# Altium project PCB_Project.PrjPcb
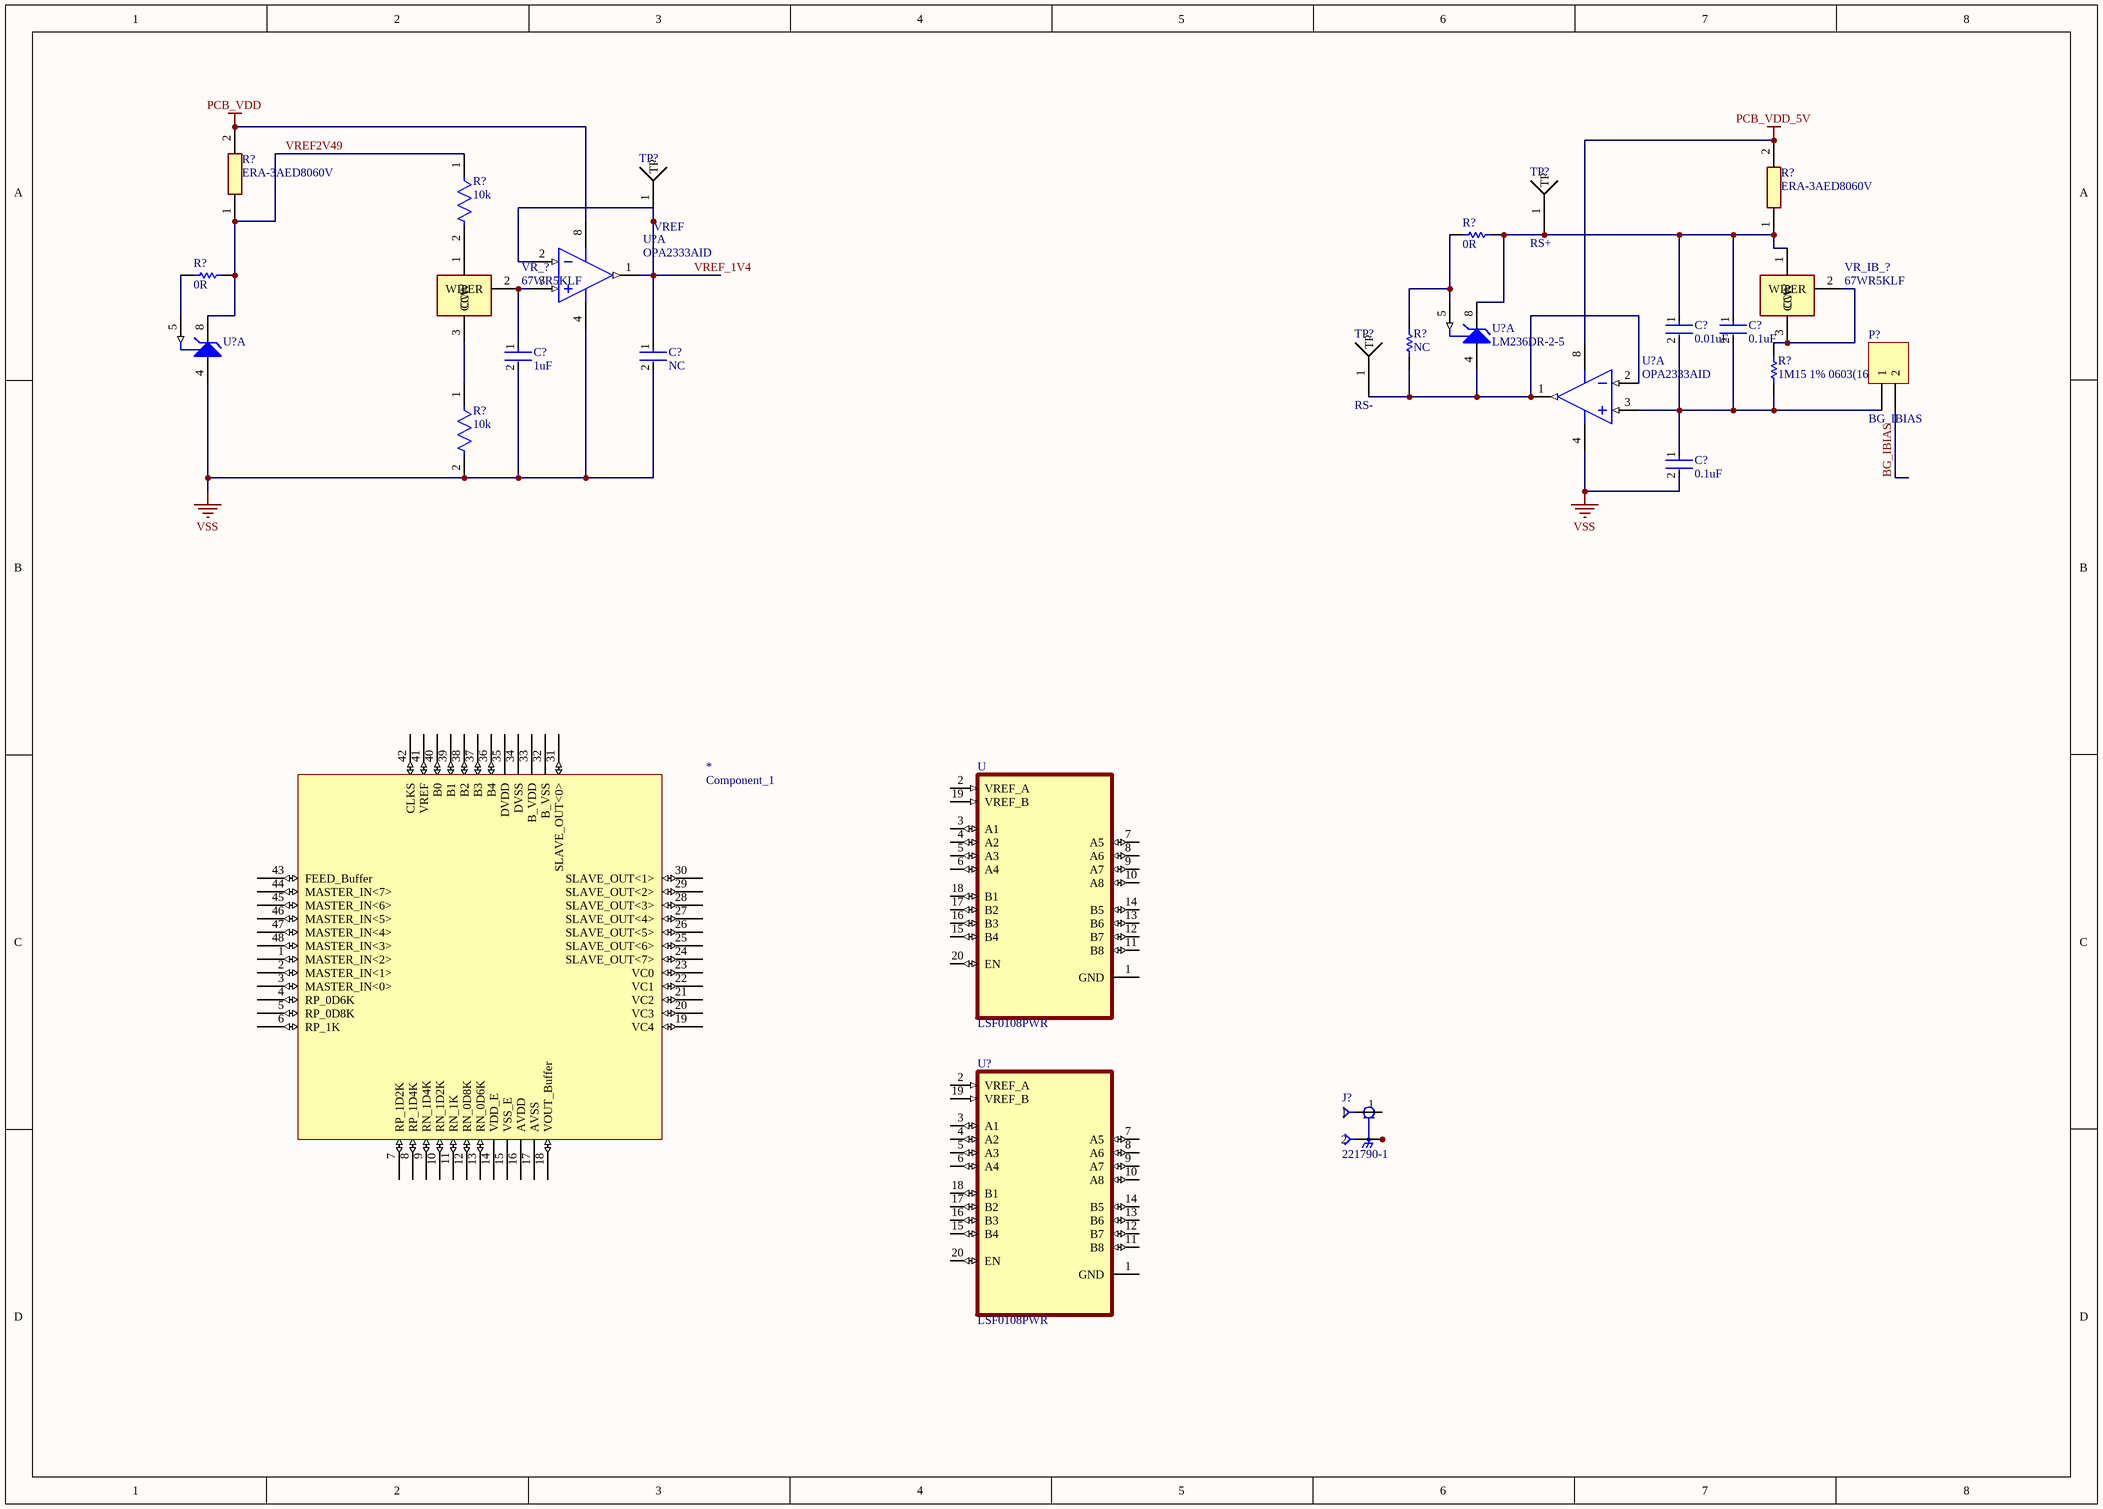
[diagram p0: ADPLL.SchDoc]
2 sheets, 140 parts. Net scope: global (net labels, ports and power ports of the same name join across sheets).
Board file: ADPLL_v1.PcbDoc
Sheets:
  ADPLL.SchDoc
  IADC_PCB_SCH.SchDoc

## Sheet ADPLL.SchDoc
size A3; SheetNumber: 1; SheetTotal: 2

### Parts
(Parts that share a designator on the sheet are numbered #1, #2 ... from top to bottom, then left to right.)
*  Component_1  [SB48(DIP48)]
C?#1  0.01uF  [FP-CC0603-DA-MFG]
C?#2  0.1uF  [FP-CC0603-DA-MFG]
C?#3  1uF  [FP-CC0603-DA-MFG]
C?#4  NC  [FP-CC0603-DA-MFG]
C?#5  0.1uF  [FP-CC0603-DA-MFG]
J?  221790-1  [TE_221790-1]
P?  BG_IBIAS  [HDR1X2]
R?#1  10k  [FP-RC0603-0_55-MFG]
R?#2  ERA-3AED8060V  [ERA3AEB101V]
R?#3  0R  [RESC1608X55X25ML10T15]
R?#4  ERA-3AED8060V  [ERA3AEB101V]
R?#5  0R  [RESC1608X55X25ML10T15]
R?#6  NC  [RESC1608X55X25ML10T15]
R?#7  10k  [FP-RC0603-0_55-MFG]
R?#8  1M15 1% 0603(1608)  [RESC0603(1608)_N]
TP?#1  VREF  [TEST_POINT]
TP?#2  RS+  [TEST_POINT]
TP?#3  RS-  [TEST_POINT]
U  LSF0108PWR  [SOP65P640X120-20N]
U?#1  OPA2333AID  [D0008A_L]  (part A of 2)
U?#2  LM236DR-2-5  [D0008A_M]  (part A of 2)
U?#3  (no value)  [D0008A_M]  (part A of 2)
U?#4  OPA2333AID  [D0008A_L]  (part A of 2)
U?#5  LSF0108PWR  [SOP65P640X120-20N]
VR_?  67WR5KLF  [67WR5KLF]
VR_IB_?  67WR5KLF  [67WR5KLF]

### Nets
PCB_VDD: R?#2.2 U?#1.8(V+)
PCB_VDD_5V: R?#4.2 U?#4.8(V+)
VSS: C?#3.2 C?#4.2 C?#5.2 R?#7.2 U?#1.4(V-) U?#3.4(ANODE) U?#4.4(V-)
BG_IBIAS: P?.2
VREF2V49: R?#1.1 R?#2.1 R?#5.2 U?#3.8(CATHODE)
VREF_1V4: C?#4.1 TP?#1.1(TP) U?#1.1(OUT_A) U?#1.2(IN_A-)
NetC?#1_1: C?#1.1 C?#2.1 R?#3.1 R?#4.1 TP?#2.1(TP) U?#2.8(CATHODE) VR_IB_?.1(CCW)
NetC?#1_2: C?#1.2 C?#2.2 C?#5.1 P?.1 R?#8.1 U?#4.3(IN_A+)
NetC?#3_1: C?#3.1 U?#1.3(IN_A+) VR_?.2(WIPER)
NetJ?_2: J?.2 J?.3 J?.4 J?.5
NetR?#1_2: R?#1.2 VR_?.1(CCW)
NetR?#3_2: R?#3.2 R?#6.1 U?#2.5(ADJ)
NetR?#5_1: R?#5.1 U?#3.5(ADJ)
NetR?#6_2: R?#6.2 TP?#3.1(TP) U?#2.4(ANODE) U?#4.1(OUT_A) U?#4.2(IN_A-)
NetR?#7_1: R?#7.1 VR_?.3(CW)
NetR?#8_2: R?#8.2 VR_IB_?.2(WIPER) VR_IB_?.3(CW)

Not connected (* = marked no-connect by the designer): * 1(MASTER_IN<2>) 2(MASTER_IN<1>) 3(MASTER_IN<0>) 4(RP_0D6K) 5(RP_0D8K) 6(RP_1K) 7(RP_1D2K) 8(RP_1D4K) 9(RN_1D4K) 10(RN_1D2K) 11(RN_1K) 12(RN_0D8K) 13(RN_0D6K) 14(VDD_E) 15(VSS_E) 16(AVDD) 17(AVSS) 18(VOUT_Buffer) 19(VC4) 20(VC3) 21(VC2) 22(VC1) 23(VC0) 24(SLAVE_OUT<7>) 25(SLAVE_OUT<6>) 26(SLAVE_OUT<5>) 27(SLAVE_OUT<4>) 28(SLAVE_OUT<3>) 29(SLAVE_OUT<2>) 30(SLAVE_OUT<1>) 31(SLAVE_OUT<0>) 32(B_VSS) 33(B_VDD) 34(DVSS) 35(DVDD) 36(B4) 37(B3) 38(B2) 39(B1) 40(B0) 41(VREF) 42(CLKS) 43(FEED_Buffer) 44(MASTER_IN<7>) 45(MASTER_IN<6>) 46(MASTER_IN<5>) 47(MASTER_IN<4>) 48(MASTER_IN<3>); J? 1; U 1(GND) 2(VREF_A) 3(A1) 4(A2) 5(A3) 6(A4) 7(A5) 8(A6) 9(A7) 10(A8) 11(B8) 12(B7) 13(B6) 14(B5) 15(B4) 16(B3) 17(B2) 18(B1) 19(VREF_B) 20(EN); U?#5 1(GND) 2(VREF_A) 3(A1) 4(A2) 5(A3) 6(A4) 7(A5) 8(A6) 9(A7) 10(A8) 11(B8) 12(B7) 13(B6) 14(B5) 15(B4) 16(B3) 17(B2) 18(B1) 19(VREF_B) 20(EN)

### Library data of the parts
C?#1 = CMP-2100-03600-2: CAP CER 10000PF 50V X7R 0603; Manufacturer Part Number: CC0603KRX7R9BB103; Manufacturer: YAGEO; Tolerance: 0.1; Material: Ceramic; Temperature Coefficient: 15%; Value: 10 nF; Mouser Description: Multilayer Ceramic Capacitor, CC Series, 0.01 - F, - 10%, X7R, 50 V, 0603 [1608 Metric]; Digikey Description: CAP CER 10000PF 50V X7R 0603; Height: 0.9mm; Category: Cap; Temperature Characteristic: X7R; Footprint Url: http://www.yageo.com/exep/pages/download/literatures/UPY-C_GEN_24.pdf; Lead Free: Yes; Voltage Rating: 50 V; Temperature: -55°C to +125°C; Device Class L3: Ceramic Capacitors; ComponentLink2Description: Datasheet; Voltage: 50 V; Package: CC0603-DA; Octopart: https://octopart.com/cc0603krx7r9bb103-yageo-192938; Automotive: No; Temperature Range High: +125°C; Temperature Range Low: -55°C; RoHS: TRUE; Device Class L1: Passive Components; ComponentLink2URL: http://www.yageo.com/documents/recent/UPY-GPHC_X7R_6.3V-to-50V_18.pdf; Device Class L2: Capacitors; Capacitance: 10 nF
C?#2 C?#5 = CMP-2100-03601-2: CAP CER 0.1UF 50V X7R 0603; Manufacturer: YAGEO; Manufacturer Part Number: CC0603KRX7R9BB104; Material: Ceramic; Capacitance: 100 nF; Temperature Coefficient: 15%; Tolerance: 0.1; Value: 100 nF; Height: 0.9mm; Voltage: 50 V; ComponentLink2Description: Datasheet; Device Class L2: Capacitors; Temperature Range High: +125°C; Category: Cap; Footprint Url: http://www.yageo.com/exep/pages/download/literatures/UPY-C_GEN_24.pdf; ComponentLink2URL: http://www.yageo.com/documents/recent/UPY-GPHC_X7R_6.3V-to-50V_18.pdf; Package: CC0603-DA; Temperature: -55°C to +125°C; Voltage Rating: 50 V; Temperature Characteristic: X7R; Device Class L1: Passive Components; Temperature Range Low: -55°C; RoHS: TRUE; Automotive: No; Device Class L3: Ceramic Capacitors; Octopart: https://octopart.com/cc0603krx7r9bb104-yageo-42244635; Mouser Description: Multilayer Ceramic Capacitor, CC Series, 0.1 - F, - 10%, X7R, 50 V, 0603 [1608 Metric]; Lead Free: Yes; Digikey Description: CAP CER 0.1UF 50V X7R 0603
C?#3 C?#4 = CMP-03422-000924-1: CAP CER 1UF 16V X7R 0603; Manufacturer: YAGEO; Manufacturer Part Number: CC0603KRX7R7BB105; Tolerance: 0.1; Temperature Coefficient: 15%; Material: Ceramic; Package: CC0603-DA; RoHS: TRUE; Device Class L2: Capacitors; Temperature Characteristic: X7R; Temperature: -55°C to +125°C; Temperature Range Low: -55°C; Automotive: No; ComponentLink2Description: Datasheet; Value: 1 uF; Lead Free: Yes; Capacitance: 1 uF; ComponentLink2URL: http://www.yageo.com/documents/recent/UPY-GPHC_X7R_6.3V-to-50V_18.pdf; Device Class L1: Passive Components; Voltage: 16 V; Octopart: https://octopart.com/cc0603krx7r7bb105-yageo-42271928; Category: Cap; Digikey Description: CAP CER 1UF 16V X7R 0603; Footprint Url: http://www.yageo.com/exep/pages/download/literatures/UPY-C_GEN_24.pdf; Height: 0.9mm; Voltage Rating: 16 V; Temperature Range High: +125°C; Mouser Description: Multilayer Ceramic Capacitor, CC Series, 1 - F, - 10%, X7R, 16 V, 0603 [1608 Metric]; Device Class L3: Ceramic Capacitors
J? = 221790-1: <b>Connector; SMA; PCB; Right Angle; Stainless Steel; 0.6 in.; Beryllium Copper</b>; Package: None; MP: 221790-1; Value: *; Availability: Unavailable; Price: None
P? = Header 2: Header, 2-Pin; LatestRevisionDate: 17-Jul-2002; LatestRevisionNote: Re-released for DXP Platform.; Publisher: Altium Limited
R?#1 R?#7 = CMP-2100-03664-2: RES 10K OHM 1% 1/10W 0603; Voltage Rating: 75V; Voltage Rating (DC): 50V; Resistance: 10kR; Power Rating: 100mW; Temperature Coefficient: 100ppm/°C; Depth: 0.8mm; Termination: SMD/SMT; Resistor Type: Thick Film; Series: RC; Construction: Rectangular; Features: Moisture Resistant; Packaging: Tape and Reel; Min Operating Temperature: -55°C; Number of Terminations: 2; Lead Pitch: 0.3mm; RoHS Compliant: Yes; Case/Package: 0603; Resistance Tolerance: 1%; Military Standard: Not; Weight: 7.1E-05oz; Number of Pins: 2; Tolerance: 1%; Length: 1.6mm; Case Code (Imperial): 0603; Lead Free: Lead Free; Width: 0.8mm; Max Power Dissipation: 100mW; Height: 0.45mm; Max Operating Temperature: 155°C; Case Code (Metric): 1608; Size Code: 0603
R?#2 R?#4 = ERA-3AED8060V: Resistor; Manufacturer_Name: Panasonic; Datasheet Link: https://industrial.panasonic.com/cdbs/www-data/pdf/RDM0000/AOA0000C307.pdf; Height: 0.55mm; Manufacturer_Part_Number: ERA-3AED8060V; Mouser Part Number: 667-ERA-3AED8060V; Mouser Price/Stock: https://www.mouser.co.uk/ProductDetail/Panasonic/ERA-3AED8060V?qs=MNPzkKEzRtQXSFvTLdZNVA%3D%3D; Arrow Part Number: ERA-3AED8060V; Arrow Price/Stock: https://www.arrow.com/en/products/era-3aed8060v/panasonic
R?#3 R?#5 R?#6 = CMP-2100-03667-1: Chip Resistor, 0 Ohm, +/- 5%, 0.1 W, -55 to 155 degC, 0603 (1608 Metric), RoHS, Tape and Reel; Manufacturer: Yageo; Temperature Coefficient: 200ppm/degreesC; Voltage Rating: 50V; Power Rating: 100mW; Resistance: 0mOhm; Width: 0.8mm; Max Operating Temperature: 155degC; Tolerance: 5%; Package Reference: 0603; Height: 0.45mm; Depth: 0.8mm; Package Description: 2-Pin Surface Mount Device, Body 1.6 x 0.8 mm; Termination: SMD/SMT; Package Quantity: 5000; Case/Package: 0603; Case Code (Imperial): 0603; Radiation Hardening: No; Number of Pins: 2; Length: 1.6mm; Lead Free: LeadFree; Voltage Rating (DC): 50V; Military Standard: Not; Datasheet URL: http://www.yageo.com/NewPortal/yageodocoutput?fileName=/pdf/R-Chip/PYu-RC_Group_51_RoHS_L_5.pdf; Manufacturer URL: http://www.yageo.com/; Packaging: TapeandReel; Case Code (Metric): 1608; Min Operating Temperature: -55degC; Composition: ThickFilm; RoHSCompliant: true; Contact Plating: Tin; Datasheet Version: Rev. 5, 10/2016; REACH SVHC: NoSVHC
R?#8 = CMP-1012-00855-1: 1M15 0.1W 1% 0603 (1608 Metric)  SMD; Value: 1150000.00 Ohm; Case-EIA: 0603; Case-Metric: 1608; Technology: SMT; Power: 0.1 W; Tolerance: 1 %
TP?#1-TP?#3 = TP
U U?#5 = LSF0108PWR: Octal Bidirectional Multi-Voltage-Level Translator 20-TSSOP -40 to 125; MF: Texas Instruments; Texas_Instruments-Purchase-URL: https://snapeda.com/shop?store=Texas+Instruments&id=353489; SnapEDA_Link: https://www.snapeda.com/parts/LSF0108PWR/Texas%20Instruments/view-part/353489/?ref=snap; Value: *; Package: TSSOP-20 Texas Instruments; MP: LSF0108PWR
U?#1 U?#4 = CMP-0272-00776-3: 17 uA, MicroPower, Precision, Zero Drift CMOS Operational Amplifier, 1.8 to 5.5 V, -40 to 125 degC, 8-pin SOIC (D8), Green (RoHS & no Sb/Br); Manufacturer: Texas Instruments; CMRR(Min)(dB): 106; IIB(Max)(pA): 200; Sub Family: Low Offset Voltage Amplifier (<=500uV), Low Power Amp (<=500uA), Low Supply Voltage Amplifier (<=2.7V), Precision Amplifier, Zero Drift Precision Amplifier; Number of Channels: 2; Vio (25C)(Max)(mV): 0.01; Slew Rate(Typ)(V/us): 0.16; Total Supply Voltage(Min)(+5V is 5, +/-5V is 10): 1.8; Total Supply Voltage(Max)(+5V is 5, +/-5V is 10): 5.5; Offset Drift(Typ)(uV/C): 0.02; Iq per channel(Max)(mA): 0.025; ComponentLink3Description: Package Specification; ComponentLink2URL: http://www.ti.com/general/docs/lit/getliterature.tsp?genericPartNumber=OPA2333&fileType=pdf; PackageDescription: 8-Pin Plastic Small Outline, Body 4.9 x 3.9 mm, Pitch 1.27 mm; PackageVersion: 4040047-3/M, 06/2011; Eco-Plan: Green (RoHS & no Sb/Br); ComponentLink1Description: Manufacturer URL; ComponentLink1URL: http://www.ti.com/; ComponentLink2Description: Datasheet; PartNumber: OPA2333AID; Mounting Technology: Surface Mount; DatasheetVersion: SBOS351C; ComponentLink3URL: http://www.ti.com/litv/pdf/msoi002j; PackageReference: D0008A; Code_JEDEC: MS-012
U?#2 = CMP-0366-00496-2: Integrated Reference Circuit, 2.49 V, 13 ppm / degC, 10 mA, -25 to 85 degC, 8-pin SOIC (D), Green (RoHS & no Sb/Br); Manufacturer: Texas Instruments; Iout/Iz(Max)(mA): 10; Initial Accuracy @ 25/deg C(%): 2; Min Iz for Regulation(uA): 400; SubFamily: Shunt Voltage Reference; Temp Coeff(Typ)(ppm/ degree C): 13; Rating: Catalog; VO(V): 2.49; Temp Coeff(Max)(ppm/ degree C): 33; Mounting Technology: Surface Mount; PackageReference: D0008A; ComponentLink1URL: http://www.ti.com/; ComponentLink2URL: http://www.ti.com/general/docs/lit/getliterature.tsp?genericPartNumber=LM236-2.5&fileType=pdf; PackageVersion: 4040047-3/M; PackageDescription: 8-Pin Plastic Small Outline, Body 4.9 x 3.9 mm, Pitch 1.27 mm; ComponentLink2Description: Datasheet; ComponentLink3Description: Package Specification; ComponentLink1Description: Manufacturer URL; ComponentLink3URL: http://www.ti.com/litv/pdf/msoi002j; Eco-Plan: Green (RoHS & no Sb/Br); DatasheetVersion: SLVS063E; PartNumber: LM236DR-2-5; Code_JEDEC: MS-012
U?#3 = CMP-0366-00496-2: Integrated Reference Circuit, 2.49 V, 13 ppm / degC, 10 mA, -25 to 85 degC, 8-pin SOIC (D), Green (RoHS & no Sb/Br); Manufacturer: Texas Instruments; PartNumber: LM236DR-2-5; Iout/Iz(Max)(mA): 10; Initial Accuracy @ 25/deg C(%): 2; Min Iz for Regulation(uA): 400; SubFamily: Shunt Voltage Reference; Temp Coeff(Typ)(ppm/ degree C): 13; Rating: Catalog; VO(V): 2.49; Temp Coeff(Max)(ppm/ degree C): 33; Mounting Technology: Surface Mount; PackageReference: D0008A; ComponentLink1URL: http://www.ti.com/; ComponentLink2URL: http://www.ti.com/general/docs/lit/getliterature.tsp?genericPartNumber=LM236-2.5&fileType=pdf; PackageVersion: 4040047-3/M; PackageDescription: 8-Pin Plastic Small Outline, Body 4.9 x 3.9 mm, Pitch 1.27 mm; ComponentLink2Description: Datasheet; ComponentLink3Description: Package Specification; ComponentLink1Description: Manufacturer URL; ComponentLink3URL: http://www.ti.com/litv/pdf/msoi002j; Eco-Plan: Green (RoHS & no Sb/Br); DatasheetVersion: SLVS063E; Code_JEDEC: MS-012
VR_? = 67WR5KLF: Variable Resistor 5K; Manufacturer_Name: TT Electronics; Datasheet Link: https://datasheet.datasheetarchive.com/originals/distributors/Datasheets-DGA16/937159.pdf; Height: 12.36mm; Manufacturer_Part_Number: 67WR5KLF; Mouser Part Number: 858-67WR5KLF; Mouser Price/Stock: https://www.mouser.co.uk/ProductDetail/BI-Technologies-TT-Electronics/67WR5KLF?qs=gQBTb7UQo2IZpYWbSQGElA%3D%3D; Arrow Part Number: 67WR5KLF; Arrow Price/Stock: https://www.arrow.com/en/products/67wr5klf/bi-technologies?region=europe
VR_IB_? = 67WR5KLF: Variable Resistor 10K; Manufacturer_Name: TT Electronics; Datasheet Link: https://datasheet.datasheetarchive.com/originals/distributors/Datasheets-DGA16/937159.pdf; Height: 12.36mm; Manufacturer_Part_Number: 67WR5KLF; Mouser Part Number: 858-67WR5KLF; Mouser Price/Stock: https://www.mouser.co.uk/ProductDetail/BI-Technologies-TT-Electronics/67WR5KLF?qs=gQBTb7UQo2IZpYWbSQGElA%3D%3D; Arrow Part Number: 67WR5KLF; Arrow Price/Stock: https://www.arrow.com/en/products/67wr5klf/bi-technologies?region=europe

## Sheet IADC_PCB_SCH.SchDoc
size A2; SheetNumber: 1; SheetTotal: 1; SPICEModelCacheYJWEAEQR: <root> / <DocumentId>YJWEAEQR</DocumentId> / </root>
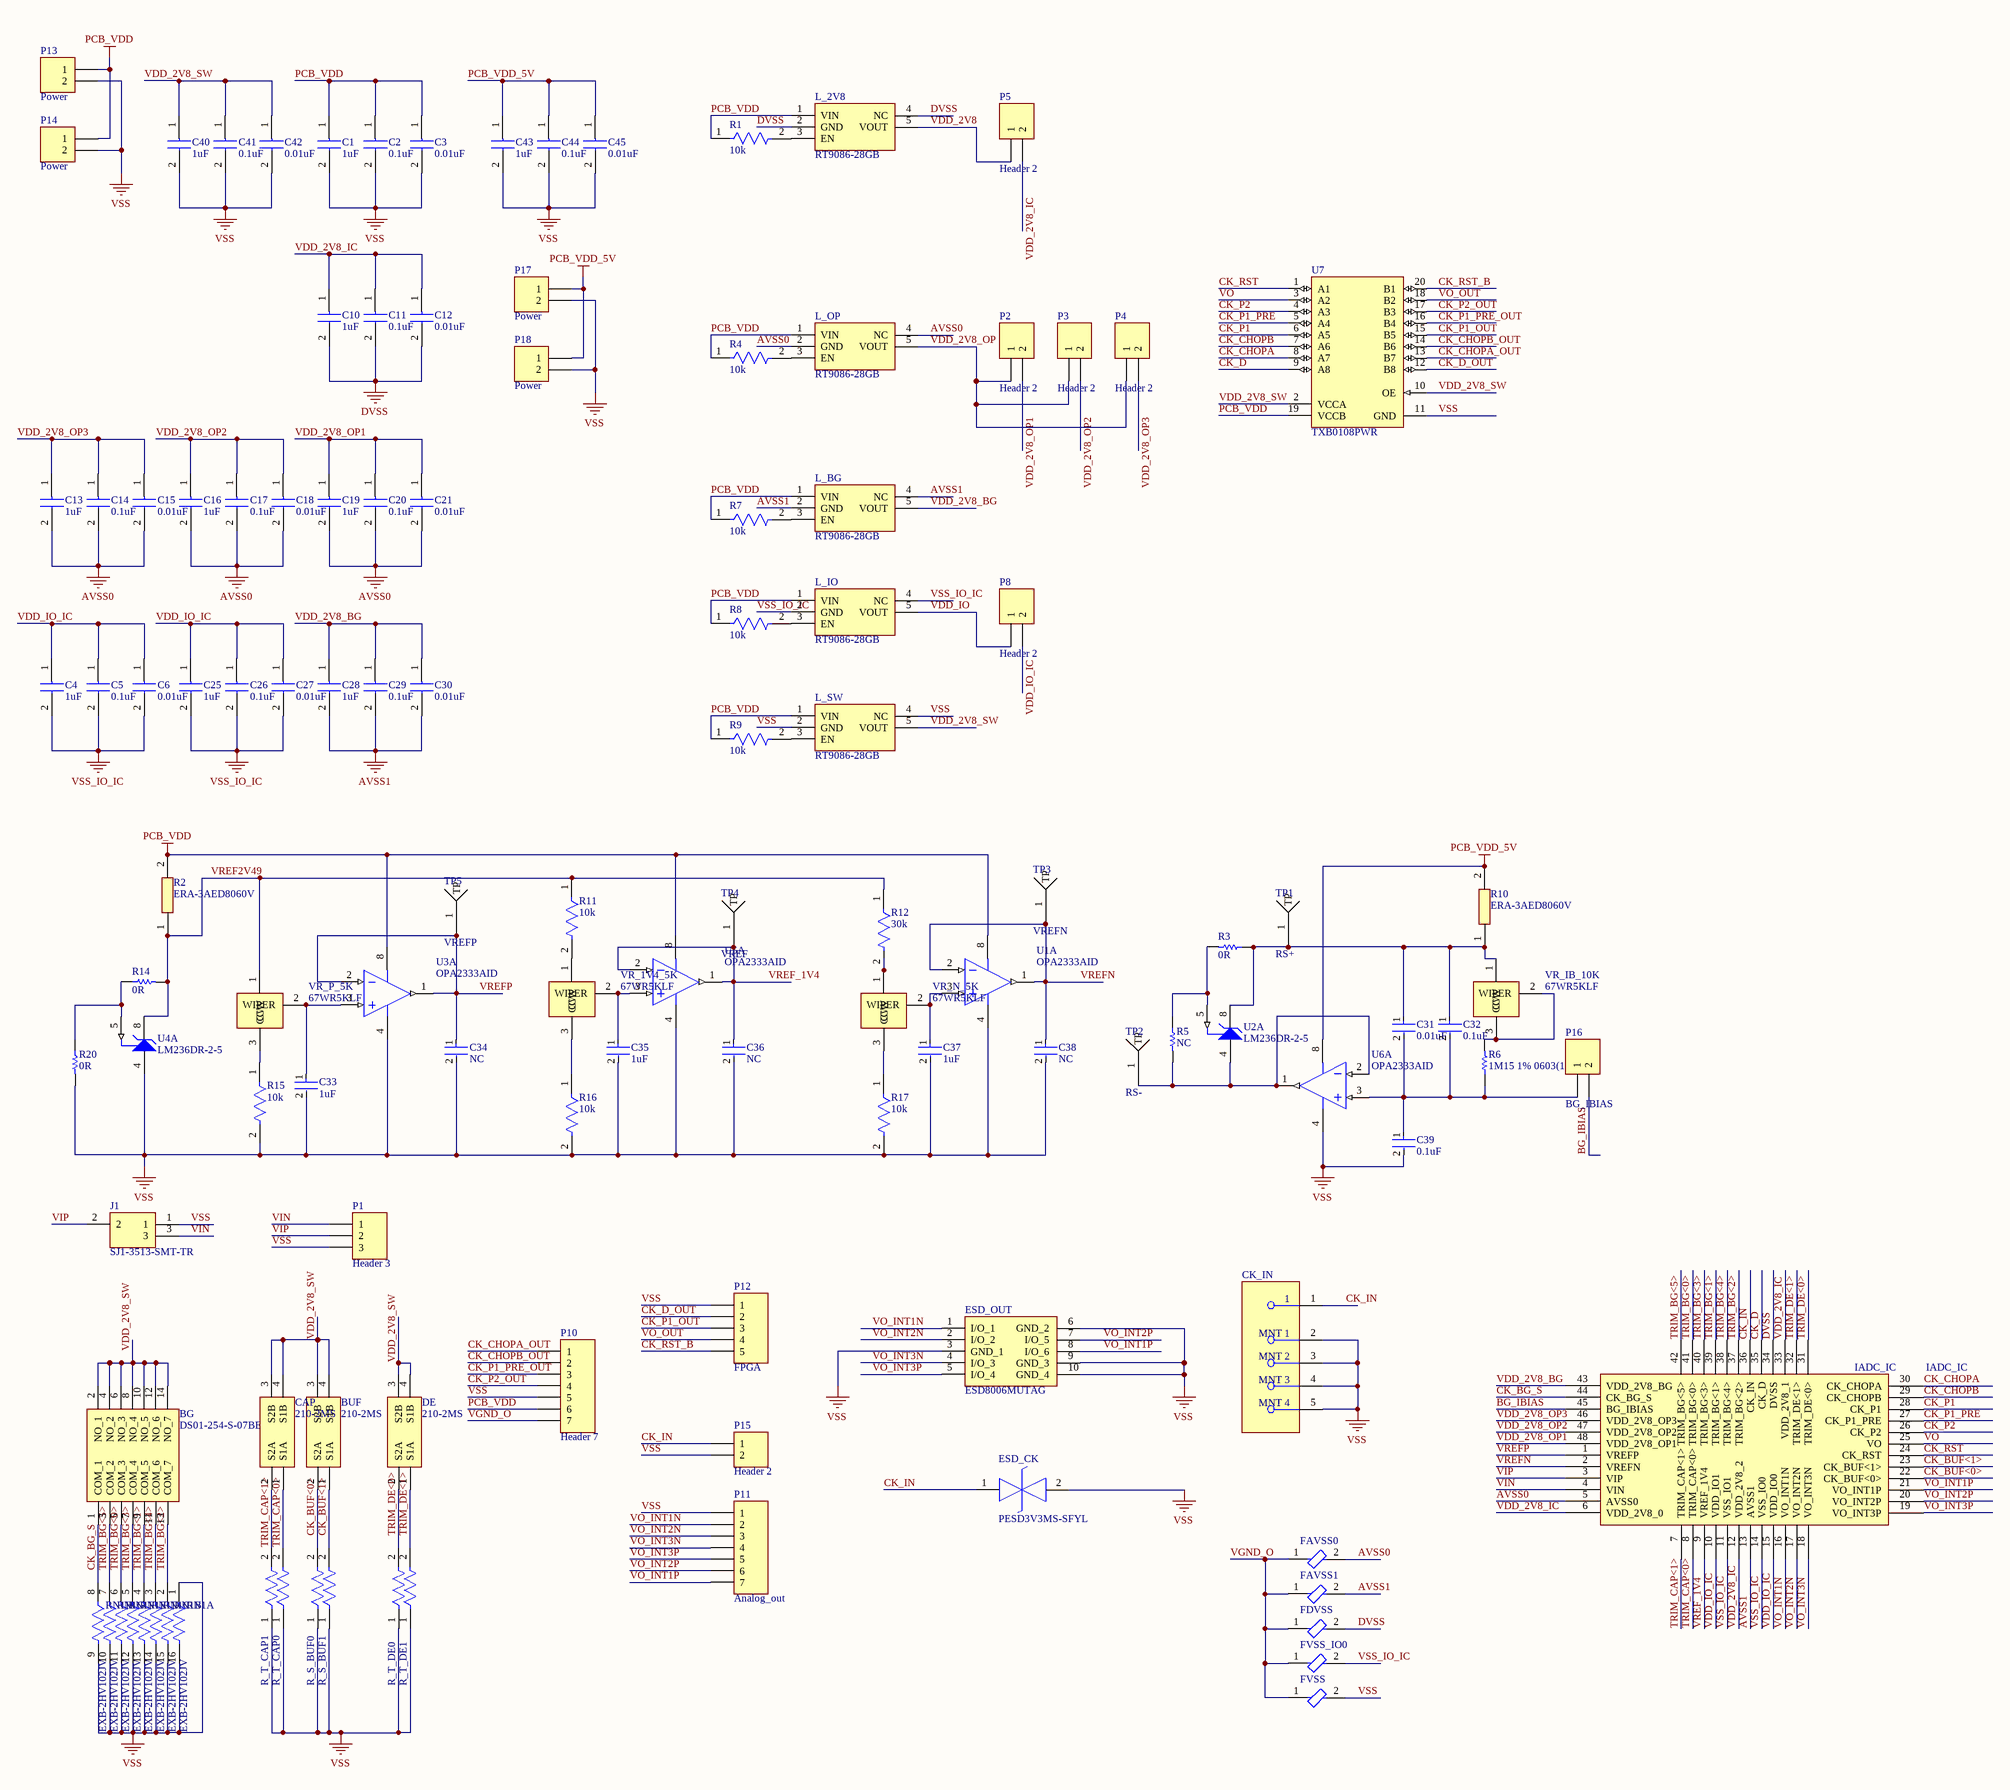
[diagram p1: IADC_PCB_SCH.SchDoc]

### Parts
BG  DS01-254-S-07BE  [DS01254S07BE]
BUF  210-2MS  [DIP775W63P254L655H458Q4N]
C1  1uF  [CAPC1608X95N]
C2  0.1uF  [CAPC1608X90N]
C3  0.01uF  [CAPC1608X95N]
C4  1uF  [CAPC1608X95N]
C5  0.1uF  [CAPC1608X90N]
C6  0.01uF  [CAPC1608X95N]
C10  1uF  [CAPC1608X95N]
C11  0.1uF  [CAPC1608X90N]
C12  0.01uF  [CAPC1608X95N]
C13  1uF  [CAPC1608X95N]
C14  0.1uF  [CAPC1608X90N]
C15  0.01uF  [CAPC1608X95N]
C16  1uF  [CAPC1608X95N]
C17  0.1uF  [CAPC1608X90N]
C18  0.01uF  [CAPC1608X95N]
C19  1uF  [CAPC1608X95N]
C20  0.1uF  [CAPC1608X90N]
C21  0.01uF  [CAPC1608X95N]
C25  1uF  [CAPC1608X95N]
C26  0.1uF  [CAPC1608X90N]
C27  0.01uF  [CAPC1608X95N]
C28  1uF  [CAPC1608X95N]
C29  0.1uF  [CAPC1608X90N]
C30  0.01uF  [CAPC1608X95N]
C31  0.01uF  [FP-CC0603-DA-MFG]
C32  0.1uF  [FP-CC0603-DA-MFG]
C33  1uF  [FP-CC0603-DA-MFG]
C34  NC  [FP-CC0603-DA-MFG]
C35  1uF  [FP-CC0603-DA-MFG]
C36  NC  [FP-CC0603-DA-MFG]
C37  1uF  [FP-CC0603-DA-MFG]
C38  NC  [FP-CC0603-DA-MFG]
C39  0.1uF  [FP-CC0603-DA-MFG]
C40  1uF  [CAPC1608X95N]
C41  0.1uF  [CAPC1608X90N]
C42  0.01uF  [CAPC1608X95N]
C43  1uF  [CAPC1608X95N]
C44  0.1uF  [CAPC1608X90N]
C45  0.01uF  [CAPC1608X95N]
CAP  210-2MS  [DIP775W63P254L655H458Q4N]
CK_IN  221790-1  [FP-221790-1-MFG]  (value not drawn)
DE  210-2MS  [DIP775W63P254L655H458Q4N]
ESD_CK  PESD3V3MS-SFYL  [PMEG3005AESFYL]
ESD_OUT  ESD8006MUTAG  [ESD8006MUTAG]
FAVSS0  742792609  [FP-742792609-MFG]  (value not drawn)
FAVSS1  742792609  [FP-742792609-MFG]  (value not drawn)
FDVSS  742792609  [FP-742792609-MFG]  (value not drawn)
FVSS  742792609  [FP-742792609-MFG]  (value not drawn)
FVSS_IO0  742792609  [FP-742792609-MFG]  (value not drawn)
IADC_IC  IADC_IC  [SB48 (DIP48)]
J1  SJ1-3513-SMT-TR  [SJ13513SMTTR]
L_2V8  RT9086-28GB  [SOT94P279X130-5N]
L_BG  RT9086-28GB  [SOT94P279X130-5N]
L_IO  RT9086-28GB  [SOT94P279X130-5N]
L_OP  RT9086-28GB  [SOT94P279X130-5N]
L_SW  RT9086-28GB  [SOT94P279X130-5N]
P1  Header 3  [HDR1X3]
P2  Header 2  [HDR1X2]
P3  Header 2  [HDR1X2]
P4  Header 2  [HDR1X2]
P5  Header 2  [HDR1X2]
P8  Header 2  [HDR1X2]
P10  Header 7  [HDR1X7]
P11  Analog_out  [HDR1X7]
P12  FPGA  [HDR1X5]
P13  Power  [HDR1X2]
P14  Power  [HDR1X2]
P15  Header 2  [HDR1X2]
P16  BG_IBIAS  [HDR1X2]
P17  Power  [HDR1X2]
P18  Power  [HDR1X2]
R1  10k  [FP-RC0603-0_55-IPC_C]
R2  ERA-3AED8060V  [ERA3AEB101V]
R3  0R  [RESC1608X55X25ML10T15]
R4  10k  [FP-RC0603-0_55-IPC_C]
R5  NC  [RESC1608X55X25ML10T15]
R6  1M15 1% 0603(1608)  [RESC0603(1608)_N]
R7  10k  [FP-RC0603-0_55-IPC_C]
R8  10k  [FP-RC0603-0_55-IPC_C]
R9  10k  [FP-RC0603-0_55-IPC_C]
R10  ERA-3AED8060V  [ERA3AEB101V]
R11  10k  [FP-RC0603-0_55-MFG]
R12  30k  [FP-RC0603-0_55-MFG]
R14  0R  [RESC1608X55X25ML10T15]
R15  10k  [FP-RC0603-0_55-MFG]
R16  10k  [FP-RC0603-0_55-MFG]
R17  10k  [FP-RC0603-0_55-MFG]
R20  0R  [RESC1608X55X25ML10T15]
R_S_BUF0  RT0603BRD071KL  [FP-RT0603-MFG]  (value not drawn)
R_S_BUF1  RT0603BRD071KL  [FP-RT0603-MFG]  (value not drawn)
R_T_CAP0  RT0603BRD071KL  [FP-RT0603-MFG]  (value not drawn)
R_T_CAP1  RT0603BRD071KL  [FP-RT0603-MFG]  (value not drawn)
R_T_DE0  RT0603BRD071KL  [FP-RT0603-MFG]  (value not drawn)
R_T_DE1  RT0603BRD071KL  [FP-RT0603-MFG]  (value not drawn)
RN1  EXB-2HV102JV  [FP-EXB2HV-MFG]  (parts A,B,C,D,E,F,G,H of 8)
TP1  RS+  [TEST_POINT]
TP2  RS-  [TEST_POINT]
TP3  VREFN  [TEST_POINT]
TP4  VREF  [TEST_POINT]
TP5  VREFP  [TEST_POINT]
U1  OPA2333AID  [D0008A_L]  (part A of 2)
U2  LM236DR-2-5  [D0008A_M]  (part A of 2)
U3  OPA2333AID  [D0008A_L]  (part A of 2)
U4  LM236DR-2-5  [D0008A_M]  (part A of 2)
U5  OPA2333AID  [D0008A_L]  (part A of 2)
U6  OPA2333AID  [D0008A_L]  (part A of 2)
U7  TXB0108PWR  [PW0020A_L]
VR_1V4_5K  67WR5KLF  [67WR5KLF]
VR_IB_10K  67WR5KLF  [67WR5KLF]
VR_N_5K  67WR5KLF  [67WR5KLF]
VR_P_5K  67WR5KLF  [67WR5KLF]

### Nets
AVSS0: C13.2 C14.2 C15.2 C16.2 C17.2 C18.2 C19.2 C20.2 C21.2 FAVSS0.2 IADC_IC.5(AVSS0) L_OP.2(GND) L_OP.4(NC)
AVSS1: C28.2 C29.2 C30.2 FAVSS1.2 IADC_IC.13(AVSS1) L_BG.2(GND) L_BG.4(NC)
DVSS: C10.2 C11.2 C12.2 FDVSS.2 IADC_IC.34(DVSS) L_2V8.2(GND) L_2V8.4(NC)
PCB_VDD: C1.1 C2.1 C3.1 L_2V8.1(VIN) L_BG.1(VIN) L_IO.1(VIN) L_OP.1(VIN) L_SW.1(VIN) P10.6 P13.1 P14.1 R1.1 R2.2 R4.1 R7.1 R8.1 R9.1 U1.8(V+) U3.8(V+) U5.8(V+) U7.19(VCCB)
PCB_VDD_5V: C43.1 C44.1 C45.1 P17.1 P18.1 R10.2 U6.8(V+)
VSS: C1.2 C2.2 C3.2 C33.2 C34.2 C35.2 C36.2 C37.2 C38.2 C39.2 C40.2 C41.2 C42.2 C43.2 C44.2 C45.2 CK_IN.2(MNT_1) CK_IN.3(MNT_2) CK_IN.4(MNT_3) CK_IN.5(MNT_4) ESD_CK.2(K2) ESD_OUT.3(GND_1) ESD_OUT.6(GND_2) ESD_OUT.9(GND_3) ESD_OUT.10(GND_4) FVSS.2 J1.1 L_SW.2(GND) L_SW.4(NC) P1.3 P10.5 P11.1 P12.1 P13.2 P14.2 P15.2 P17.2 P18.2 R15.2 R16.2 R17.2 R20.2 R_S_BUF0.1 R_S_BUF1.1 R_T_CAP0.1 R_T_CAP1.1 R_T_DE0.1 R_T_DE1.1 RN1.1 RN1.9 RN1.10 RN1.11 RN1.12 RN1.13 RN1.14 RN1.15 RN1.16 U1.4(V-) U3.4(V-) U4.4(ANODE) U5.4(V-) U6.4(V-) U7.11(GND)
VSS_IO_IC: C4.2 C5.2 C6.2 C25.2 C26.2 C27.2 FVSS_IO0.2 IADC_IC.11(VSS_IO1) IADC_IC.14(VSS_IO0) L_IO.2(GND) L_IO.4(NC)
BG_IBIAS: IADC_IC.45(BG_IBIAS) P16.2
CK_BG_S: BG.1(COM_1) IADC_IC.44(CK_BG_S) RN1.8
CK_BUF<0>: BUF.2(S2A) IADC_IC.22(CK_BUF<0>) R_S_BUF0.2
CK_BUF<1>: BUF.1(S1A) IADC_IC.23(CK_BUF<1>) R_S_BUF1.2
CK_CHOPA: IADC_IC.30(CK_CHOPA) U7.8(A7)
CK_CHOPA_OUT: P10.1 U7.13(B7)
CK_CHOPB: IADC_IC.29(CK_CHOPB) U7.7(A6)
CK_CHOPB_OUT: P10.2 U7.14(B6)
CK_D: IADC_IC.35(CK_D) U7.9(A8)
CK_D_OUT: P12.2 U7.12(B8)
CK_IN: CK_IN.1 ESD_CK.1(K1) IADC_IC.36(CK_IN) P15.1
CK_P1: IADC_IC.28(CK_P1) U7.6(A5)
CK_P1_OUT: P12.3 U7.15(B5)
CK_P1_PRE: IADC_IC.27(CK_P1_PRE) U7.5(A4)
CK_P1_PRE_OUT: P10.3 U7.16(B4)
CK_P2: IADC_IC.26(CK_P2) U7.4(A3)
CK_P2_OUT: P10.4 U7.17(B3)
CK_RST: IADC_IC.24(CK_RST) U7.1(A1)
CK_RST_B: P12.5 U7.20(B1)
TRIM_BG<0>: BG.5(COM_3) IADC_IC.41(TRIM_BG<0>) RN1.6
TRIM_BG<1>: BG.9(COM_5) IADC_IC.39(TRIM_BG<1>) RN1.4
TRIM_BG<2>: BG.13(COM_7) IADC_IC.37(TRIM_BG<2>) RN1.2
TRIM_BG<3>: BG.7(COM_4) IADC_IC.40(TRIM_BG<3>) RN1.5
TRIM_BG<4>: BG.11(COM_6) IADC_IC.38(TRIM_BG<4>) RN1.3
TRIM_BG<5>: BG.3(COM_2) IADC_IC.42(TRIM_BG<5>) RN1.7
TRIM_CAP<0>: CAP.1(S1A) IADC_IC.8(TRIM_CAP<0>) R_T_CAP0.2
TRIM_CAP<1>: CAP.2(S2A) IADC_IC.7(TRIM_CAP<1>) R_T_CAP1.2
TRIM_DE<0>: DE.2(S2A) IADC_IC.31(TRIM_DE<0>) R_T_DE0.2
TRIM_DE<1>: DE.1(S1A) IADC_IC.32(TRIM_DE<1>) R_T_DE1.2
VDD_2V8: L_2V8.5(VOUT) P5.1
VDD_2V8_BG: C28.1 C29.1 C30.1 IADC_IC.43(VDD_2V8_BG) L_BG.5(VOUT)
VDD_2V8_IC: C10.1 C11.1 C12.1 IADC_IC.6(VDD_2V8_0) IADC_IC.12(VDD_2V8_2) IADC_IC.33(VDD_2V8_1) P5.2
VDD_2V8_OP: L_OP.5(VOUT) P2.1 P3.1 P4.1
VDD_2V8_OP1: C19.1 C20.1 C21.1 IADC_IC.48(VDD_2V8_OP1) P2.2
VDD_2V8_OP2: C16.1 C17.1 C18.1 IADC_IC.47(VDD_2V8_OP2) P3.2
VDD_2V8_OP3: C13.1 C14.1 C15.1 IADC_IC.46(VDD_2V8_OP3) P4.2
VDD_2V8_SW: BG.2(NO_1) BG.4(NO_2) BG.6(NO_3) BG.8(NO_4) BG.10(NO_5) BG.12(NO_6) BG.14(NO_7) BUF.3(S2B) BUF.4(S1B) C40.1 C41.1 C42.1 CAP.3(S2B) CAP.4(S1B) DE.3(S2B) DE.4(S1B) L_SW.5(VOUT) U7.2(VCCA) U7.10(OE)
VDD_IO: L_IO.5(VOUT) P8.1
VDD_IO_IC: C4.1 C5.1 C6.1 C25.1 C26.1 C27.1 IADC_IC.10(VDD_IO1) IADC_IC.15(VDD_IO0) P8.2
VGND_O: FAVSS0.1 FAVSS1.1 FDVSS.1 FVSS.1 FVSS_IO0.1 P10.7
VIN: IADC_IC.4(VIN) J1.3 P1.1
VIP: IADC_IC.3(VIP) J1.2 P1.2
VO: IADC_IC.25(VO) U7.3(A2)
VO_INT1N: ESD_OUT.1(I/O_1) IADC_IC.16(VO_INT1N) P11.2
VO_INT1P: ESD_OUT.8(I/O_6) IADC_IC.21(VO_INT1P) P11.7
VO_INT2N: ESD_OUT.2(I/O_2) IADC_IC.17(VO_INT2N) P11.3
VO_INT2P: ESD_OUT.7(I/O_5) IADC_IC.20(VO_INT2P) P11.6
VO_INT3N: ESD_OUT.4(I/O_3) IADC_IC.18(VO_INT3N) P11.4
VO_INT3P: ESD_OUT.5(I/O_4) IADC_IC.19(VO_INT3P) P11.5
VO_OUT: P12.4 U7.18(B2)
VREF2V49: R2.1 R11.1 R12.1 R14.2 U4.8(CATHODE) VR_P_5K.1(CCW)
VREF_1V4: C36.1 IADC_IC.9(VREF_1V4) TP4.1(TP) U5.1(OUT_A) U5.2(IN_A-)
VREFN: C38.1 IADC_IC.2(VREFN) TP3.1(TP) U1.1(OUT_A) U1.2(IN_A-)
VREFP: C34.1 IADC_IC.1(VREFP) TP5.1(TP) U3.1(OUT_A) U3.2(IN_A-)
NetC31_1: C31.1 C32.1 R3.1 R10.1 TP1.1(TP) U2.8(CATHODE) VR_IB_10K.1(CCW)
NetC31_2: C31.2 C32.2 C39.1 P16.1 R6.1 U6.3(IN_A+)
NetC33_1: C33.1 U3.3(IN_A+) VR_P_5K.2(WIPER)
NetC35_1: C35.1 U5.3(IN_A+) VR_1V4_5K.2(WIPER)
NetC37_1: C37.1 U1.3(IN_A+) VR_N_5K.2(WIPER)
NetL_2V8_3: L_2V8.3(EN) R1.2
NetL_BG_3: L_BG.3(EN) R7.2
NetL_IO_3: L_IO.3(EN) R8.2
NetL_OP_3: L_OP.3(EN) R4.2
NetL_SW_3: L_SW.3(EN) R9.2
NetR3_2: R3.2 R5.1 U2.5(ADJ)
NetR5_2: R5.2 TP2.1(TP) U2.4(ANODE) U6.1(OUT_A) U6.2(IN_A-)
NetR6_2: R6.2 VR_IB_10K.2(WIPER) VR_IB_10K.3(CW)
NetR11_2: R11.2 VR_1V4_5K.1(CCW)
NetR12_2: R12.2 VR_N_5K.1(CCW)
NetR14_1: R14.1 R20.1 U4.5(ADJ)
NetR15_1: R15.1 VR_P_5K.3(CW)
NetR16_1: R16.1 VR_1V4_5K.3(CW)
NetR17_1: R17.1 VR_N_5K.3(CW)

### Library data of the parts
BG = DS01-254-S-07BE: Switch; Manufacturer_Name: CUI Devices; Datasheet Link: https://www.mouser.in/datasheet/2/670/ds01_254-1777712.pdf; Height: 7mm; Manufacturer_Part_Number: DS01-254-S-07BE; Mouser Part Number: 490-DS01-254-S-07BE; Mouser Price/Stock: https://www.mouser.co.uk/ProductDetail/CUI-Devices/DS01-254-S-07BE?qs=wnTfsH77Xs4LW3hFeno2Ow%3D%3D; Arrow Part Number: DS01-254-S-07BE; Arrow Price/Stock: https://www.arrow.com/en/products/ds01-254-s-07be/cui-devices?region=nac
BUF CAP DE = 210-2MS: Switch; Manufacturer_Name: CTS; Datasheet Link: https://componentsearchengine.com/Datasheets/1/210-2MS.pdf; Height: 4.58mm; Manufacturer_Part_Number: 210-2MS; Mouser Part Number: 774-2102MS; Mouser Price/Stock: https://www.mouser.co.uk/ProductDetail/CTS-Electronic-Components/210-2MS?qs=hDoPxpGr7ldHQa2fpEXONg%3D%3D; Arrow Part Number: 210-2MS; Arrow Price/Stock: https://www.arrow.com/en/products/210-2ms/cts
C1 C4 C10 C13 C16 C19 C25 C28 C40 C43 = CC0603KRX7R9BB105: 多層陶瓷電容器MLCC - SMD/SMT 50V 1uF X7R 0603 10% HI CV; Manufacturer_Name: YAGEO; Datasheet Link: https://www.yageo.com/upload/media/product/app/datasheet/mlcc/upy-gphc_x7r_6_3v-to-250v.pdf; Height: 0.95mm; Manufacturer_Part_Number: CC0603KRX7R9BB105; Mouser Part Number: 603-CC603KRX7R9BB105; Mouser Price/Stock: https://www.mouser.co.uk/ProductDetail/YAGEO/CC0603KRX7R9BB105?qs=6wERJjOp3mmF17%252BYi8cgJQ%3D%3D; Arrow Part Number: CC0603KRX7R9BB105; Arrow Price/Stock: https://www.arrow.com/en/products/cc0603krx7r9bb105/yageo?region=nac
C2 C5 C11 C14 C17 C20 C26 C29 C41 C44 = CC0603KRX7R8BB104: 多層陶瓷電容器MLCC - SMD/SMT 25 V 0.1uF X7R 0603 10%; Manufacturer_Name: YAGEO; Datasheet Link: https://www.arrow.com/en/products/cc0603krx7r8bb104/yageo?region=nac; Height: 0.9mm; Manufacturer_Part_Number: CC0603KRX7R8BB104; Mouser Part Number: 603-CC603KRX7R8BB104; Mouser Price/Stock: https://www.mouser.co.uk/ProductDetail/YAGEO/CC0603KRX7R8BB104?qs=AgBp2OyFlx%252B4QOgEm%2Fb3YQ%3D%3D; Arrow Part Number: CC0603KRX7R8BB104; Arrow Price/Stock: https://www.arrow.com/en/products/cc0603krx7r8bb104/yageo?region=nac
C3 C6 C12 C15 C18 C21 C27 C30 C42 C45 = CC0603KRX7R9BB105_1: 多層陶瓷電容器MLCC - SMD/SMT 25V 0.01uF X7R 0603 10%; Manufacturer_Name: YAGEO; Datasheet Link: https://www.yageo.com/upload/media/product/app/datasheet/mlcc/upy-gphc_x7r_6_3v-to-250v.pdf; Height: 0.95mm; Manufacturer_Part_Number: CC0603KRX7R9BB105; Mouser Part Number: 603-CC603KRX7R9BB105; Mouser Price/Stock: https://www.mouser.co.uk/ProductDetail/YAGEO/CC0603KRX7R9BB105?qs=6wERJjOp3mmF17%252BYi8cgJQ%3D%3D; Arrow Part Number: CC0603KRX7R9BB105; Arrow Price/Stock: https://www.arrow.com/en/products/cc0603krx7r9bb105/yageo?region=nac
C31 = CMP-2100-03600-2: as C?#1 on sheet ADPLL; Mouser Description: Multilayer Ceramic Capacitor, CC Series, 0.01 - F, - 10%, X7R, 50 V, 0603 [1608 Metric]; Digikey Description: CAP CER 10000PF 50V X7R 0603; Height: 0.9mm; Category: Cap; Temperature Characteristic: X7R; Footprint Url: http://www.yageo.com/exep/pages/download/literatures/UPY-C_GEN_24.pdf; Lead Free: Yes; Voltage Rating: 50 V; Temperature: -55°C to +125°C; Device Class L3: Ceramic Capacitors; ComponentLink2Description: Datasheet; Voltage: 50 V; Package: CC0603-DA; Octopart: https://octopart.com/cc0603krx7r9bb103-yageo-192938; Automotive: No; Temperature Range High: +125°C; Temperature Range Low: -55°C; RoHS: TRUE; Device Class L1: Passive Components; ComponentLink2URL: http://www.yageo.com/documents/recent/UPY-GPHC_X7R_6.3V-to-50V_18.pdf; Device Class L2: Capacitors; Capacitance: 10 nF
C32 C39 = CMP-2100-03601-2: as C?#2 on sheet ADPLL; Height: 0.9mm; Voltage: 50 V; ComponentLink2Description: Datasheet; Device Class L2: Capacitors; Temperature Range High: +125°C; Category: Cap; Footprint Url: http://www.yageo.com/exep/pages/download/literatures/UPY-C_GEN_24.pdf; ComponentLink2URL: http://www.yageo.com/documents/recent/UPY-GPHC_X7R_6.3V-to-50V_18.pdf; Package: CC0603-DA; Temperature: -55°C to +125°C; Voltage Rating: 50 V; Temperature Characteristic: X7R; Device Class L1: Passive Components; Temperature Range Low: -55°C; RoHS: TRUE; Automotive: No; Device Class L3: Ceramic Capacitors; Octopart: https://octopart.com/cc0603krx7r9bb104-yageo-42244635; Mouser Description: Multilayer Ceramic Capacitor, CC Series, 0.1 - F, - 10%, X7R, 50 V, 0603 [1608 Metric]; Lead Free: Yes; Digikey Description: CAP CER 0.1UF 50V X7R 0603
C33-C38 = CMP-03422-000924-1: as C?#3 on sheet ADPLL; Package: CC0603-DA; RoHS: TRUE; Device Class L2: Capacitors; Temperature Characteristic: X7R; Temperature: -55°C to +125°C; Temperature Range Low: -55°C; Automotive: No; ComponentLink2Description: Datasheet; Value: 1 uF; Lead Free: Yes; Capacitance: 1 uF; ComponentLink2URL: http://www.yageo.com/documents/recent/UPY-GPHC_X7R_6.3V-to-50V_18.pdf; Device Class L1: Passive Components; Voltage: 16 V; Octopart: https://octopart.com/cc0603krx7r7bb105-yageo-42271928; Category: Cap; Digikey Description: CAP CER 1UF 16V X7R 0603; Footprint Url: http://www.yageo.com/exep/pages/download/literatures/UPY-C_GEN_24.pdf; Height: 0.9mm; Voltage Rating: 16 V; Temperature Range High: +125°C; Mouser Description: Multilayer Ceramic Capacitor, CC Series, 1 - F, - 10%, X7R, 16 V, 0603 [1608 Metric]; Device Class L3: Ceramic Capacitors
CK_IN = CMP-05166-000001-1: CONN SMA JACK R/A 50 OHM PCB; Manufacturer: TE Connectivity / AMP; Is Female: yes; Impedance: 50Ω; Number Of Contacts: 1; Shielding: true; Voltage Rating: 335V; Frequency: 4GHz; Dielectric Material: Fluoropolymer; Conn Orientation: Right Angle; Octopart: https://octopart.com/2217901-te+connectivity+%2F+amp-3339836; Contact Material: Gold; Temperature: -65°C to +165°C; RoHS: TRUE; Device Class L1: Connectors; Temperature Range Low: -65°C; Mouser Description: RF Connectors / Coaxial Connectors PCB RIGHT ANGLE JACK; Lead Free: Yes; Manufacturer Part Number: 221790-1; Device Class L3: unset; Temperature Range High: +165°C; ComponentLink2URL: https://www.te.com/commerce/DocumentDelivery/DDEController?Action=showdoc&DocId=Customer+Drawing%7F221790%7FB1%7Fpdf%7FEnglish%7FENG_CD_221790_B1.pdf%7F221790-1; Package: 0; ComponentLink2Description: Datasheet; Digikey Description: CONN SMA JACK R/A 50 OHM PCB; Device Class L2: RF / Coaxial Connectors; Category: Conn; Height: 0.38inch; Automotive: No
ESD_CK = PESD3V3MS-SFYL: Diode ESD (Bi-directional); Manufacturer_Name: Nexperia; Datasheet Link: https://assets.nexperia.com/documents/data-sheet/PESD3V3MS-SF.pdf; Manufacturer_Part_Number: PESD3V3MS-SFYL; Mouser Part Number: 771-PESD3V3MS-SFYL; Mouser Price/Stock: https://www.mouser.co.uk/ProductDetail/Nexperia/PESD3V3MS-SFYL?qs=PqoDHHvF649O8q3DsbG1Aw%3D%3D; Arrow Part Number: PESD3V3MS-SFYL; Arrow Price/Stock: https://www.arrow.com/en/products/pesd3v3ms-sfyl/nexperia
ESD_OUT = ESD8006MUTAG: Integrated Circuit; Manufacturer_Name: onsemi; Datasheet Link: https://www.onsemi.com/pdf/datasheet/esd8006-d.pdf; Height: 0.55mm; Manufacturer_Part_Number: ESD8006MUTAG; Mouser Part Number: 863-ESD8006MUTAG; Mouser Price/Stock: https://www.mouser.co.uk/ProductDetail/onsemi/ESD8006MUTAG?qs=Tr3lMbyRyKmyu7WByjNAZw%3D%3D; Arrow Part Number: ESD8006MUTAG; Arrow Price/Stock: https://www.arrow.com/en/products/esd8006mutag/on-semiconductor?region=nac
FAVSS0 FAVSS1 FDVSS FVSS FVSS_IO0 = CMP-0220-00193-2: FERRITE BEAD 30 OHM 0603 1LN; Max Current Rating: 3A; Number of Lines: 1; Test Frequency: 100MHz; Impedance: 30R; Resistance: 40mR; Inductance: 5.6H; Tolerance: 25%; Current Rating: 1A; Max DC Current: 3A; Case/Package: SMD/SMT; Height: 0.8mm; Material: Ferrite; Length: 1.6mm; Max Operating Temperature: 125°C; Depth: 0.8mm; Min Operating Temperature: -55°C; Series: WE-CBF; Core Material: Ferrite; Mount: Surface Mount; Termination: SMD/SMT; Width: 0.8mm; RoHS Compliant: Yes; Weight: 0.000141oz; Case Code (Imperial): 0603; Packaging: Tape and Reel; Case Code (Metric): 1608; Package Quantity: 1; DC Resistance (DCR): 40mR
J1 = SJ1-3513-SMT-TR: Connector; Manufacturer_Name: CUI Devices; Datasheet Link: https://datasheet.datasheetarchive.com/originals/distributors/Datasheets-DGA1/151944.pdf; Height: 5mm; Manufacturer_Part_Number: SJ1-3513-SMT-TR; Mouser Part Number: 490-SJ1-3513-SMT-TR; Mouser Price/Stock: https://www.mouser.co.uk/ProductDetail/CUI-Devices/SJ1-3513-SMT-TR?qs=WyjlAZoYn51Dgh9SyYXHxw%3D%3D; Arrow Part Number: SJ1-3513-SMT-TR; Arrow Price/Stock: https://www.arrow.com/en/products/sj1-3513-smt-tr/cui-devices?region=europe
L_2V8 L_BG L_IO L_OP L_SW = RT9086-28GB: Integrated Circuit; Manufacturer_Name: RICHTEK; Datasheet Link: https://www.mouser.tw/datasheet/2/1458/DS9086_10-3104670.pdf; Height: 1.295mm; Manufacturer_Part_Number: RT9086-28GB
P1 = Header 3: Header, 3-Pin; LatestRevisionDate: 17-Jul-2002; LatestRevisionNote: Re-released for DXP Platform.; Publisher: Altium Limited
P2-P5 P8 P13-P18 = Header 2: Header, 2-Pin; LatestRevisionDate: 17-Jul-2002; LatestRevisionNote: Re-released for DXP Platform.; Publisher: Altium Limited
P10 P11 = Header 7: Header, 7-Pin; LatestRevisionDate: 17-Jul-2002; LatestRevisionNote: Re-released for DXP Platform.; Publisher: Altium Limited
P12 = Header 5: Header, 5-Pin; LatestRevisionDate: 17-Jul-2002; LatestRevisionNote: Re-released for DXP Platform.; Publisher: Altium Limited
R1 R4 R7-R9 R11 R12 R15-R17 = CMP-2100-03664-2: as R?#1 on sheet ADPLL; Depth: 0.8mm; Termination: SMD/SMT; Resistor Type: Thick Film; Series: RC; Construction: Rectangular; Features: Moisture Resistant; Packaging: Tape and Reel; Min Operating Temperature: -55°C; Number of Terminations: 2; Lead Pitch: 0.3mm; RoHS Compliant: Yes; Case/Package: 0603; Resistance Tolerance: 1%; Military Standard: Not; Weight: 7.1E-05oz; Number of Pins: 2; Tolerance: 1%; Length: 1.6mm; Case Code (Imperial): 0603; Lead Free: Lead Free; Width: 0.8mm; Max Power Dissipation: 100mW; Height: 0.45mm; Max Operating Temperature: 155°C; Case Code (Metric): 1608; Size Code: 0603
R2 R10 = ERA-3AED8060V: Resistor; Manufacturer_Name: Panasonic; Datasheet Link: https://industrial.panasonic.com/cdbs/www-data/pdf/RDM0000/AOA0000C307.pdf; Height: 0.55mm; Manufacturer_Part_Number: ERA-3AED8060V; Mouser Part Number: 667-ERA-3AED8060V; Mouser Price/Stock: https://www.mouser.co.uk/ProductDetail/Panasonic/ERA-3AED8060V?qs=MNPzkKEzRtQXSFvTLdZNVA%3D%3D; Arrow Part Number: ERA-3AED8060V; Arrow Price/Stock: https://www.arrow.com/en/products/era-3aed8060v/panasonic
R3 R5 R14 R20 = CMP-2100-03667-1: as R?#3 on sheet ADPLL; Width: 0.8mm; Max Operating Temperature: 155degC; Tolerance: 5%; Package Reference: 0603; Height: 0.45mm; Depth: 0.8mm; Package Description: 2-Pin Surface Mount Device, Body 1.6 x 0.8 mm; Termination: SMD/SMT; Package Quantity: 5000; Case/Package: 0603; Case Code (Imperial): 0603; Radiation Hardening: No; Number of Pins: 2; Length: 1.6mm; Lead Free: LeadFree; Voltage Rating (DC): 50V; Military Standard: Not; Datasheet URL: http://www.yageo.com/NewPortal/yageodocoutput?fileName=/pdf/R-Chip/PYu-RC_Group_51_RoHS_L_5.pdf; Manufacturer URL: http://www.yageo.com/; Packaging: TapeandReel; Case Code (Metric): 1608; Min Operating Temperature: -55degC; Composition: ThickFilm; RoHSCompliant: true; Contact Plating: Tin; Datasheet Version: Rev. 5, 10/2016; REACH SVHC: NoSVHC
R6 = CMP-1012-00855-1: as R?#8 on sheet ADPLL; Technology: SMT; Power: 0.1 W; Tolerance: 1 %
R_S_BUF0 R_S_BUF1 R_T_CAP0 R_T_CAP1 R_T_DE0 R_T_DE1 = CMP-03412-013082-1: RES SMD 1K OHM 0.1% 1/10W 0603; Manufacturer: Yageo; Voltage Rating: 75V; Temperature Coefficient: 25ppm/°C; Value: 1kΩ; Power Rating: 0.1W; Temperature Range Low: -55°C; Manufacturer Part Number: RT0603BRD071KL; Series: RT; Digikey Description: RES SMD 1K OHM 0.1% 1/10W 0603; Tolerance: 0.1%; Category: Res; RoHS: TRUE; Composition: Thin Film; ComponentLink2Description: Datasheet; Footprint Url: https://www.yageo.com/upload/website/yageo_PYu-R_Mount_10_19050818_343.pdf; Temperature: -55°C to +155°C; ComponentLink2URL: https://www.yageo.com/upload/media/product/productsearch/datasheet/rchip/PYu-RT_1-to-0.01_RoHS_L_11.pdf; Automotive: No; Octopart: https://octopart.com/rt0603brd071kl-yageo-1433776; Device Class L1: Passive Components; Device Class L2: Resistors; Temperature Range High: +155°C; Height: 0.55mm; Device Class L3: Chip SMD Resistors; Lead Free: Yes; Resistance: 1kΩ; Package: RT0603
RN1 = CMP-05421-000002-1: RES ARRAY 8 RES 1K OHM 1506; Manufacturer: Panasonic; Temperature Coefficient: 200ppm/°C; Power Per Resistor: 0.063W; Automotive Grade: Grade 1; Voltage Rating: 25V; Value: 1000Ω; Tolerance: 5%; Power Rating: 0.25W; Number Of Resistors: 8; Termination: Convex; Device Class L3: Resistor Arrays; Device Class L2: Resistors; Resistance: 1000Ω; Height: 0.55mm; Device Class L1: Passive Components; Lead Free: Yes; Temperature Range High: +125°C; Manufacturer Part Number: EXB-2HV102JV; RoHS: TRUE; Composition: Thick Film; Category: Res; Footprint Url: https://b2b-api.panasonic.eu/file_stream/pids/fileversion/1189; Digikey Description: RES ARRAY 8 RES 1K OHM 1506; Mouser Description: Resistor Networks & Arrays 1K OHM 5%; Series: EXB; Octopart: https://octopart.com/exb-2hv102jv-panasonic-55561305; Automotive: Yes; Temperature Range Low: -55°C; ComponentLink2URL: https://b2b-api.panasonic.eu/file_stream/pids/fileversion/1255; Package: EXB2HV; ComponentLink2Description: Datasheet; Temperature: -55°C to +125°C
TP1-TP5 = TP
U1 U3 U5 U6 = CMP-0272-00776-3: as U?#1 on sheet ADPLL; ComponentLink3Description: Package Specification; ComponentLink2URL: http://www.ti.com/general/docs/lit/getliterature.tsp?genericPartNumber=OPA2333&fileType=pdf; PackageDescription: 8-Pin Plastic Small Outline, Body 4.9 x 3.9 mm, Pitch 1.27 mm; PackageVersion: 4040047-3/M, 06/2011; Eco-Plan: Green (RoHS & no Sb/Br); ComponentLink1Description: Manufacturer URL; ComponentLink1URL: http://www.ti.com/; ComponentLink2Description: Datasheet; PartNumber: OPA2333AID; Mounting Technology: Surface Mount; DatasheetVersion: SBOS351C; ComponentLink3URL: http://www.ti.com/litv/pdf/msoi002j; PackageReference: D0008A; Code_JEDEC: MS-012
U2 U4 = CMP-0366-00496-2: as U?#2 on sheet ADPLL; Mounting Technology: Surface Mount; PackageReference: D0008A; ComponentLink1URL: http://www.ti.com/; ComponentLink2URL: http://www.ti.com/general/docs/lit/getliterature.tsp?genericPartNumber=LM236-2.5&fileType=pdf; PackageVersion: 4040047-3/M; PackageDescription: 8-Pin Plastic Small Outline, Body 4.9 x 3.9 mm, Pitch 1.27 mm; ComponentLink2Description: Datasheet; ComponentLink3Description: Package Specification; ComponentLink1Description: Manufacturer URL; ComponentLink3URL: http://www.ti.com/litv/pdf/msoi002j; Eco-Plan: Green (RoHS & no Sb/Br); DatasheetVersion: SLVS063E; PartNumber: LM236DR-2-5; Code_JEDEC: MS-012
U7 = CMP-2000-07337-1: TXB0108 8-Bit Bidirectional Voltage-Level Translator with Auto-Direction Sensing and / +/- 15-kV ESD Protection, 1.2 to 3.6 V, -40 to 85 degC, 20-Pin TSSOP (PW), Green (RoHS & no Sb/Br), Tape and Reel; Manufacturer: Texas Instruments; Propagation Delay (Max): 4ns; Logic Function: Translator,Bidirectional; Input Type: Logic; Package Version: 4040064-5/G, 02/2011; Voltage - Supply: 1.2V~3.6V,1.65V~5.5V; Data Rate: 100Mbps; Other Names: 296-21527-6; Number of Channels: 8; Differential - Input: Output:No/No; Number of Outputs/Channel: 1; Product Training Modules: VoltageLevelTranslation; Dynamic Catalog: TXBSeries; Package Reference: PW20; Package Description: 20-Pin Small Outline Package Integrated Circuit, Body 6.5 x 4.4 mm, Pitch 0.65 mm; Category: IntegratedCircuits(ICs); Datasheet URL: http://www.ti.com/general/docs/lit/getliterature.tsp?genericPartNumber=TXB0108&fileType=pdf; Package / Case: 20-TSSOP(0.173",4.40mmWidth); Family: Logic-Translators; Standard Package: 1; Series: -; Manufacturer URL: http://www.ti.com/; Number of Bits: 8; Package URL: http://www.ti.com/litv/pdf/mpds362; Output Type: Logic; Datasheet Version: Rev. F, 12/2014; Packaging: Digi-Reel®; Operating Temperature: -40°C~85°C; Supplier Device Package: 20-TSSOP; Mounting Technology: SurfaceMount
VR_1V4_5K VR_N_5K VR_P_5K = 67WR5KLF: as VR_? on sheet ADPLL; Datasheet Link: https://datasheet.datasheetarchive.com/originals/distributors/Datasheets-DGA16/937159.pdf; Height: 12.36mm; Manufacturer_Part_Number: 67WR5KLF; Mouser Part Number: 858-67WR5KLF; Mouser Price/Stock: https://www.mouser.co.uk/ProductDetail/BI-Technologies-TT-Electronics/67WR5KLF?qs=gQBTb7UQo2IZpYWbSQGElA%3D%3D; Arrow Part Number: 67WR5KLF; Arrow Price/Stock: https://www.arrow.com/en/products/67wr5klf/bi-technologies?region=europe
VR_IB_10K = 67WR5KLF: as VR_IB_? on sheet ADPLL; Datasheet Link: https://datasheet.datasheetarchive.com/originals/distributors/Datasheets-DGA16/937159.pdf; Height: 12.36mm; Manufacturer_Part_Number: 67WR5KLF; Mouser Part Number: 858-67WR5KLF; Mouser Price/Stock: https://www.mouser.co.uk/ProductDetail/BI-Technologies-TT-Electronics/67WR5KLF?qs=gQBTb7UQo2IZpYWbSQGElA%3D%3D; Arrow Part Number: 67WR5KLF; Arrow Price/Stock: https://www.arrow.com/en/products/67wr5klf/bi-technologies?region=europe

## Nets that join several sheets
PCB_VDD: ADPLL (R?#2.2 U?#1.8), IADC_PCB_SCH (21 pins)
PCB_VDD_5V: ADPLL (R?#4.2 U?#4.8), IADC_PCB_SCH (7 pins)
VSS: ADPLL (7 pins), IADC_PCB_SCH (63 pins)
BG_IBIAS: ADPLL (P?.2), IADC_PCB_SCH (IADC_IC.45 P16.2)
VREF2V49: ADPLL (R?#1.1 R?#2.1 R?#5.2 U?#3.8), IADC_PCB_SCH (6 pins)
VREF_1V4: ADPLL (C?#4.1 TP?#1.1 U?#1.1 U?#1.2), IADC_PCB_SCH (5 pins)